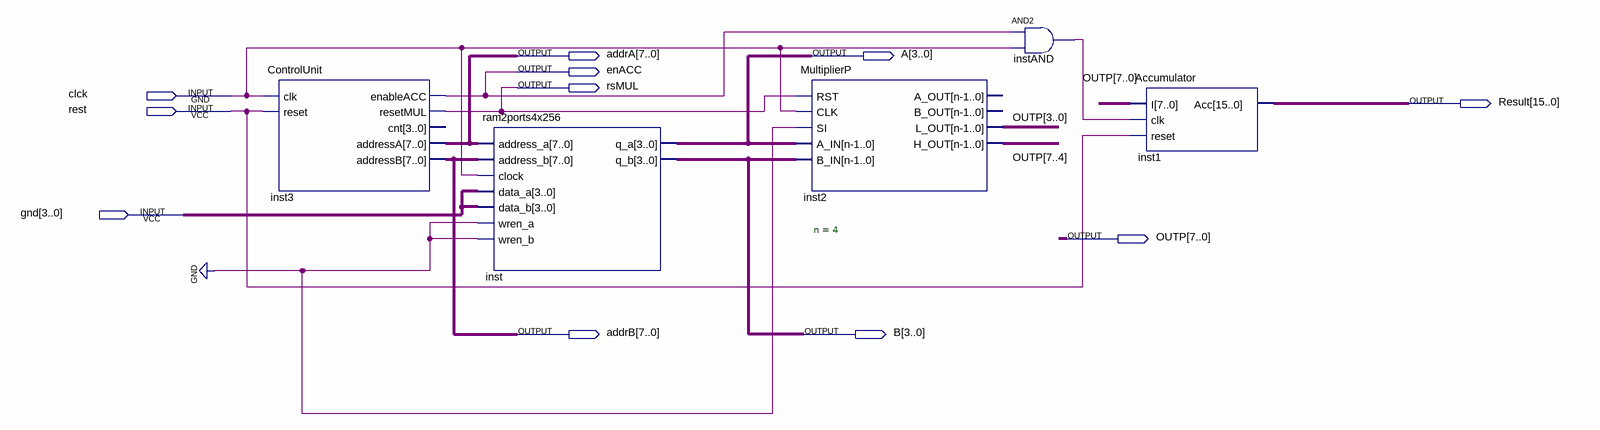
[diagram p0: schematic sheet]
// Quartus schematic Lab8.bdf as structural Verilog: 5 symbols, 11 pins
module Lab8 (
  input  clck,
  input  rest,
  input  [3:0] gnd,
  output [7:0] addrA,
  output [3:0] A,
  output enACC,
  output rsMUL,
  output [15:0] Result,
  output [7:0] OUTP,
  output [7:0] addrB,
  output [3:0] B
);

  wire instAND_out;

  ControlUnit inst3 (
    .clk(clck), .reset(rest), .enableACC(enACC), .resetMUL(rsMUL), .addressA(addrA), .addressB(addrB));  // open: cnt
  ram2ports4x256 inst (
    .address_a(addrA), .address_b(addrB), .clock(clck), .data_a(gnd), .data_b(gnd), .wren_a(1'b0),
    .wren_b(1'b0), .q_a(A), .q_b(B));
  MultiplierP #(.n(4)) inst2 (
    .RST(rsMUL), .CLK(clck), .SI(1'b0), .A_IN(A), .B_IN(B), .L_OUT(OUTP[3:0]), .H_OUT(OUTP[7:4]));  // open: A_OUT, B_OUT
  and instAND (instAND_out, enACC, clck);
  Accumulator inst1 (.I(OUTP), .clk(instAND_out), .reset(rest), .Acc(Result));
endmodule
